# Altium schematic sheet dBFS Meter.SchDoc
size A4
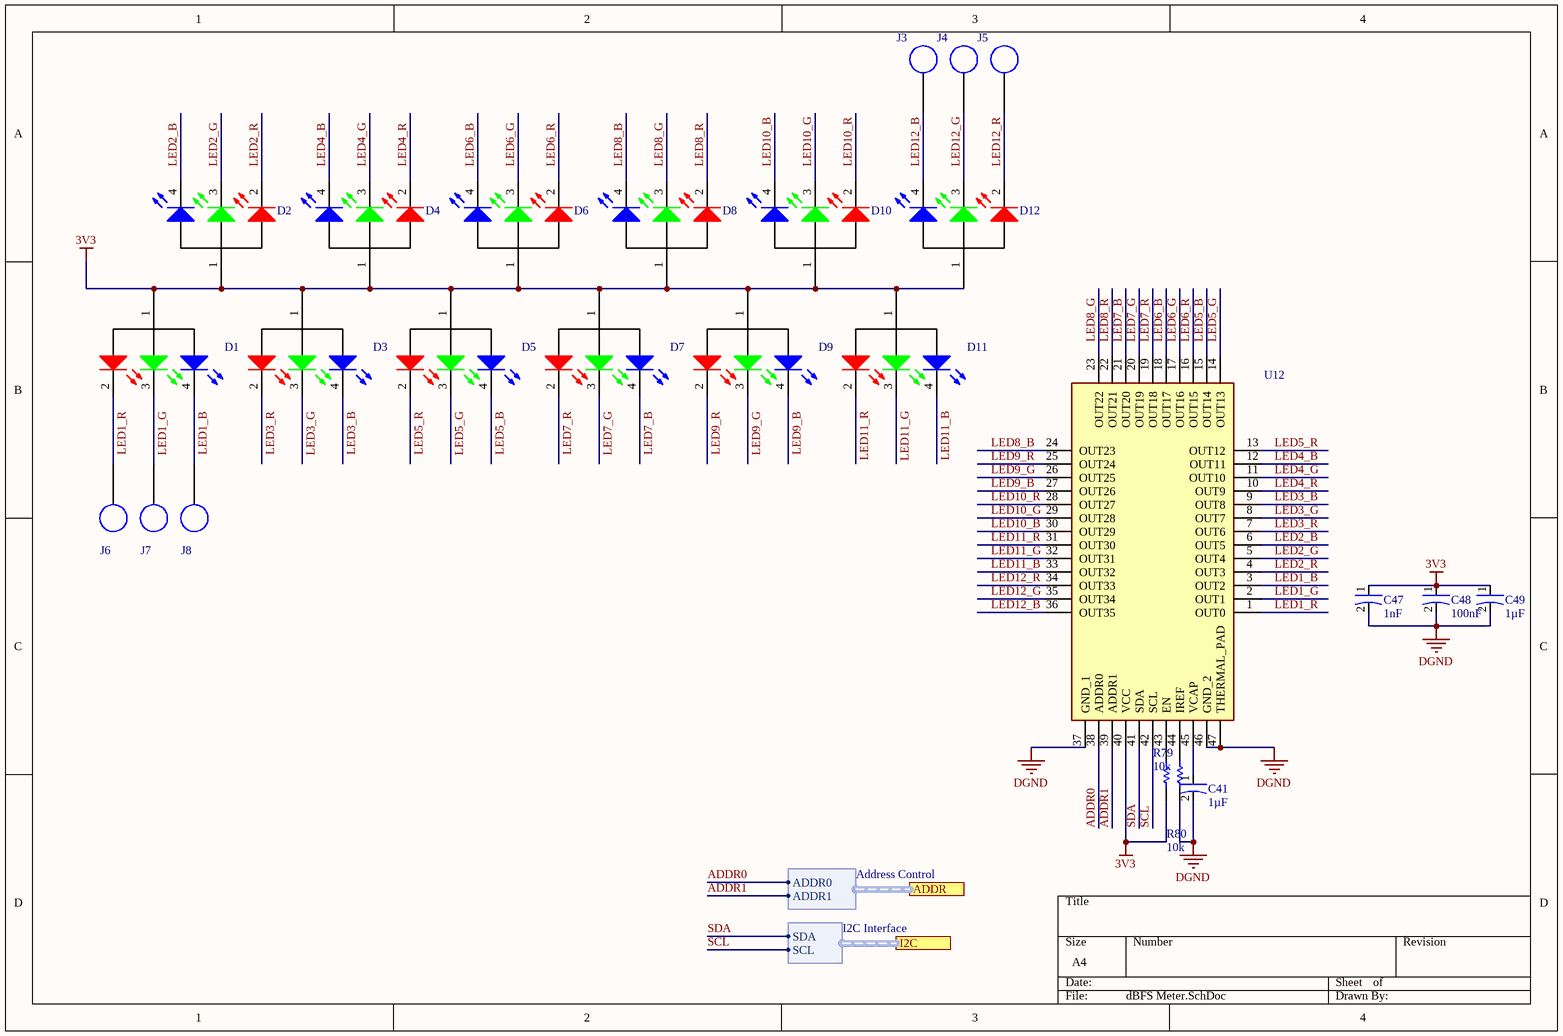
[diagram p0: dBFS Meter.SchDoc]

## Parts
C41  value 1µF  [0805-M]  (hidden comment: CAP 1uF CER 0805 25V C0G 10%)
C47  value 1nF  [0402-M]  (hidden comment: CAP 1nF CER 0402 50V X5R 10%)
C48  value 100nF  [0805-M]  (hidden comment: CAP 0.1uF CER 0805 50V  X7R 5%)
C49  value 1µF  [0402-M]  (hidden comment: CAP 1uF CER 0402 25V X5R 20%)
D1  IN-B101FCH  [SML-LXR0804RGBC-TR]  (value not drawn)
D2  IN-B101FCH  [SML-LXR0804RGBC-TR]  (value not drawn)
D3  IN-B101FCH  [SML-LXR0804RGBC-TR]  (value not drawn)
D4  IN-B101FCH  [SML-LXR0804RGBC-TR]  (value not drawn)
D5  IN-B101FCH  [SML-LXR0804RGBC-TR]  (value not drawn)
D6  IN-B101FCH  [SML-LXR0804RGBC-TR]  (value not drawn)
D7  IN-B101FCH  [SML-LXR0804RGBC-TR]  (value not drawn)
D8  IN-B101FCH  [SML-LXR0804RGBC-TR]  (value not drawn)
D9  IN-B101FCH  [SML-LXR0804RGBC-TR]  (value not drawn)
D10  IN-B101FCH  [SML-LXR0804RGBC-TR]  (value not drawn)
D11  IN-B101FCH  [SML-LXR0804RGBC-TR]  (value not drawn)
D12  IN-B101FCH  [SML-LXR0804RGBC-TR]  (value not drawn)
J3  151-203-RC  [151-203-RC-Footprint-1]  (value not drawn)
J4  151-203-RC  [151-203-RC-Footprint-1]  (value not drawn)
J5  151-203-RC  [151-203-RC-Footprint-1]  (value not drawn)
J6  151-203-RC  [151-203-RC-Footprint-1]  (value not drawn)
J7  151-203-RC  [151-203-RC-Footprint-1]  (value not drawn)
J8  151-203-RC  [151-203-RC-Footprint-1]  (value not drawn)
R79  value 10k  [0402-M]  (hidden comment: RES 10k 0402 63mW 5%)
R80  value 10k  [0402-M]  (hidden comment: RES 10k 0402 63mW 5%)
U12  LP5036RJVR  [New footprint 1]  (value not drawn)

## Ports
ADDR (harness Address Control), I2C (harness I2C Interface)

## Harnesses
Address Control: ADDR0, ADDR1
I2C Interface: SDA, SCL

## Nets
3V3: C47.1(Anode) C48.1(Anode) C49.1(Anode) D1.1(A) D2.1(A) D3.1(A) D4.1(A) D5.1(A) D6.1(A) D7.1(A) D8.1(A) D9.1(A) D10.1(A) D11.1(A) D12.1(A) R79.1 U12.40(VCC)
DGND: C41.2(Cathode) C47.2(Cathode) C48.2(Cathode) C49.2(Cathode) R80.1 U12.37(GND_1) U12.46(GND_2) U12.47(THERMAL_PAD)
ADDR0: U12.38(ADDR0) ; port ADDR.ADDR0
ADDR1: U12.39(ADDR1) ; port ADDR.ADDR1
LED1_B: D1.4(B) J8.1 U12.3(OUT2)
LED1_G: D1.3(G) J7.1 U12.2(OUT1)
LED1_R: D1.2(R) J6.1 U12.1(OUT0)
LED2_B: D2.4(B) U12.6(OUT5)
LED2_G: D2.3(G) U12.5(OUT4)
LED2_R: D2.2(R) U12.4(OUT3)
LED3_B: D3.4(B) U12.9(OUT8)
LED3_G: D3.3(G) U12.8(OUT7)
LED3_R: D3.2(R) U12.7(OUT6)
LED4_B: D4.4(B) U12.12(OUT11)
LED4_G: D4.3(G) U12.11(OUT10)
LED4_R: D4.2(R) U12.10(OUT9)
LED5_B: D5.4(B) U12.15(OUT14)
LED5_G: D5.3(G) U12.14(OUT13)
LED5_R: D5.2(R) U12.13(OUT12)
LED6_B: D6.4(B) U12.18(OUT17)
LED6_G: D6.3(G) U12.17(OUT16)
LED6_R: D6.2(R) U12.16(OUT15)
LED7_B: D7.4(B) U12.21(OUT20)
LED7_G: D7.3(G) U12.20(OUT19)
LED7_R: D7.2(R) U12.19(OUT18)
LED8_B: D8.4(B) U12.24(OUT23)
LED8_G: D8.3(G) U12.23(OUT22)
LED8_R: D8.2(R) U12.22(OUT21)
LED9_B: D9.4(B) U12.27(OUT26)
LED9_G: D9.3(G) U12.26(OUT25)
LED9_R: D9.2(R) U12.25(OUT24)
LED10_B: D10.4(B) U12.30(OUT29)
LED10_G: D10.3(G) U12.29(OUT28)
LED10_R: D10.2(R) U12.28(OUT27)
LED11_B: D11.4(B) U12.33(OUT32)
LED11_G: D11.3(G) U12.32(OUT31)
LED11_R: D11.2(R) U12.31(OUT30)
LED12_B: D12.4(B) J3.1 U12.36(OUT35)
LED12_G: D12.3(G) J4.1 U12.35(OUT34)
LED12_R: D12.2(R) J5.1 U12.34(OUT33)
SCL: U12.42(SCL) ; port I2C.SCL
SDA: U12.41(SDA) ; port I2C.SDA
NetC41_1: C41.1(Anode) U12.45(VCAP)
NetR79_2: R79.2 U12.43(EN)
NetR80_2: R80.2 U12.44(IREF)

## Library data of the parts
C41 = CAP 1uF CER 0805 25V C0G 10%-2: Manufacturer: Generic; Type: SMD; Bin: N; Source: Capacitor Library.SchLib; Design Item ID: CAP 1uF CER 0805 25V C0G 10%; Supplier 1: Mouser; Supplier Part Number 1: 810-C2012X5R1E105K; Status: Active; Case/Package: 0805
C47 = CAP 1nF CER 0402 50V X5R 10%-2: CAP-1nF-CER-0402-50V-X5R-10%; Manufacturer: Generic; Bin: N; Type: SMD; Status: Active; Source: Capacitor Library.SchLib; Supplier 1: Mouser; Case/Package: 0402; Supplier Part Number 1: 81-GRM155R61H102KA1D; Design Item ID: CAP 1nF CER 0402 50V X5R 10%
C48 = CAP 0.1uF CER 0805 50V  X7R 5%-2: CAP-0.1uF-CER-0805-50V- X7R-5%; Manufacturer: Generic; Bin: F1-C6-4; Type: SMD; Design Item ID: CAP 0.1uF CER 0805 50V  X7R 5%; Supplier 1: Mouser; Datasheet: http://www.kemet.com/Lists/ProductCatalog/Attachments/53/KEM_C1002_X7R_SMD.pdf; Source: Capacitor Library.SchLib; Case/Package: 0805; Status: Active; Supplier Part Number 1: 80-C0805C104J3R
C49 = CAP 1uF CER 0402 25V X5R 20%-2: CAP-1uF-CER-0402-25V-X5R-20%; Manufacturer: Generic; Bin: 5-FMC-CAP; Type: SMD; Design Item ID: CAP 1uF CER 0402 25V X5R 20%; Source: Capacitor Library.SchLib; Supplier 1: Mouser; Status: Active; Supplier Part Number 1: 963-TMK105CC6105MV-F; Case/Package: 0402
D1-D12 = IN-B101FCH-4: LED-0404-RGB-10mA-3.4V; Manufacturer: Inolux; Color: Blue,Green,Red; Luminous Intensity: 17mcd; Type: SMD; Status: Active; Case/Package: 0404
J3-J8 = CMP-002-00000-2: PCB-Probe-Ring; Color: Black
R79 R80 = RES 10k 0402 63mW 5%-1: RES-10k-0402-63mW-5%; Manufacturer: Generic; Bin: F1-R7-9; MAPPING: 1(2,1,11.5k); Design Item ID: RES 10k 0402 63mW 5%; Type: SMD; Status: Active; Case/Package: 0402; Source: Resistor Library.SchLib
U12 = LP5036RJVR-2: 36-Channel LED Driver - 2.7-5.5V - 1.26A/channel; Manufacturer: Texas Instruments; Case/Package: VQFN-46; Type: SMD; Status: Active